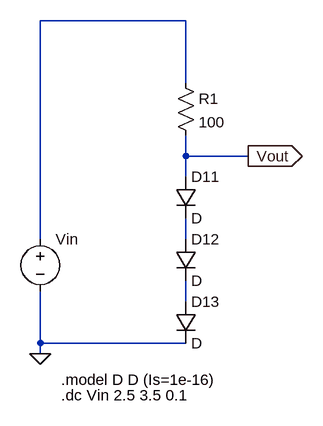
[diagram p0: schematic HW1 1-d.asc]
HW1 1-d.asc, the LTspice schematic file:
Version 4
SHEET 1 920 680
WIRE 512 -1136 288 -1136
WIRE 512 -1040 512 -1136
WIRE 512 -928 512 -960
WIRE 608 -928 512 -928
WIRE 512 -896 512 -928
WIRE 288 -800 288 -1136
WIRE 512 -800 512 -832
WIRE 512 -704 512 -736
WIRE 288 -640 288 -720
WIRE 512 -640 288 -640
WIRE 288 -624 288 -640
FLAG 288 -624 0
FLAG 608 -928 Vout
IOPIN 608 -928 Out
SYMBOL diode 496 -704 R0
SYMATTR InstName D13
SYMBOL diode 496 -800 R0
SYMATTR InstName D12
SYMBOL diode 496 -896 R0
SYMATTR InstName D11
SYMBOL voltage 288 -816 R0
WINDOW 123 0 0 Left 0
WINDOW 39 0 0 Left 0
SYMATTR InstName Vin
SYMATTR Value ""
SYMBOL res 496 -1056 R0
SYMATTR InstName R1
SYMATTR Value 100
TEXT 320 -584 Left 2 !.model D D (Is=1e-16)
TEXT 320 -560 Left 2 !.dc Vin 2.5 3.5 0.1

The netlist it stands for:
* HW1 1-d.asc
D13 N003 0 D
D12 N002 N003 D
D11 Vout N002 D
Vin N001 0
R1 N001 Vout 100
.model D D
.lib standard.dio
.model D D (Is=1e-16)
.dc Vin 2.5 3.5 0.1
.backanno
.end